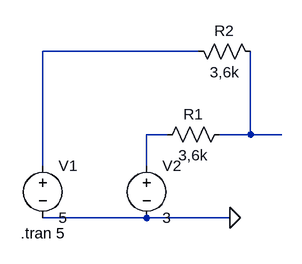
[diagram p0: schematic SUM.asc]
SUM.asc, the LTspice schematic file:
Version 4
SHEET 1 880 680
WIRE 256 -64 16 -64
WIRE 208 64 176 64
WIRE 336 64 336 -64
WIRE 336 64 288 64
WIRE 384 64 336 64
WIRE 16 112 16 -64
WIRE 176 112 176 64
WIRE 176 192 16 192
WIRE 304 192 176 192
FLAG 304 192 0
SYMBOL voltage 16 96 R0
WINDOW 123 0 0 Left 2
WINDOW 39 0 0 Left 2
SYMATTR InstName V1
SYMATTR Value 5
SYMBOL voltage 176 96 R0
WINDOW 123 0 0 Left 2
WINDOW 39 0 0 Left 2
SYMATTR InstName V2
SYMATTR Value 3
SYMBOL res 304 48 R90
WINDOW 0 0 56 VBottom 2
WINDOW 3 32 56 VTop 2
SYMATTR InstName R1
SYMATTR Value 3,6k
SYMBOL res 352 -48 M270
WINDOW 0 32 56 VTop 2
WINDOW 3 0 56 VBottom 2
SYMATTR InstName R2
SYMATTR Value 3,6k
TEXT -18 216 Left 2 !.tran 5

The netlist it stands for:
* SUM.asc
V1 N001 0 5
V2 N002 0 3
R1 N003 N002 3,6k
R2 N003 N001 3,6k
.tran 5
.backanno
.end